# EAGLE design Net Widget (EAGLE 7.2.0)
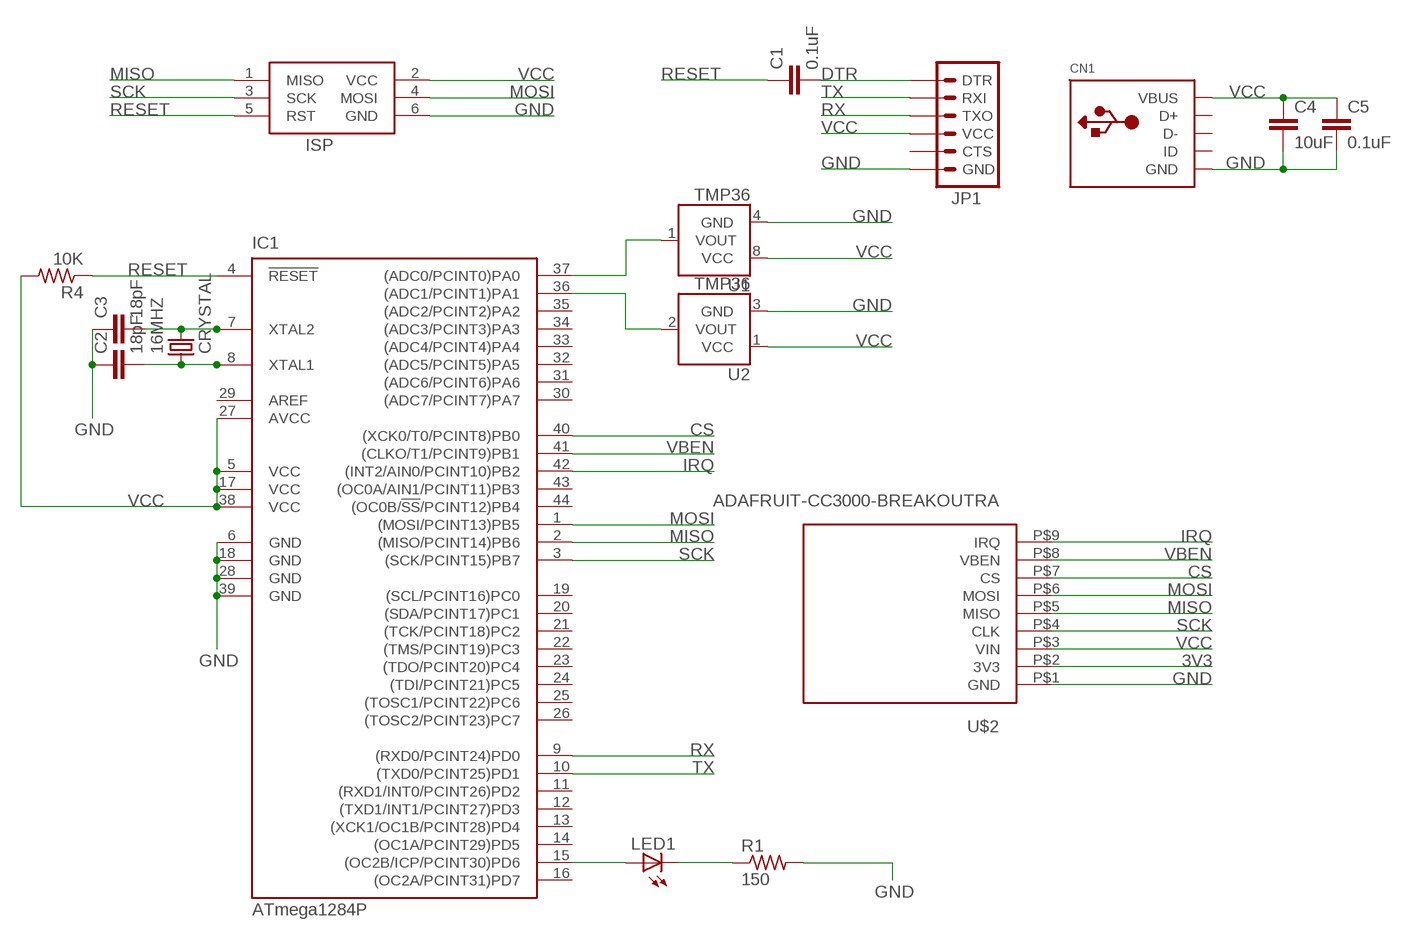
[diagram p0: schematic, sheet 1]

## Parts
16MHZ  CRYSTAL  [2-SMD-5X3MM]
C1  0.1uF  C-EUC1206  [C1206]
C2  18pF  C-EUC1206  [C1206]
C3  18pF  C-EUC1206  [C1206]
C4  10uF  C-EUC1206  [C1206]
C5  0.1uF  C-EUC1206  [C1206]
CN1  USBPWR  [USB-MINIB-POWER]
IC1  ATmega1284P  MEGA164P/324P/644P-AU  [TQFP44]
ISP  AVRISP-6  [AVRISP]
JP1  ARDUINO_SERIAL_PROGRAMSMD  [1X06-SMD]
LED1  LEDSMT1206  [1206]
R1  150  R-US_R1206  [R1206]
R4  10K  R-US_R1206  [R1206]
U1  TMP36  [SO08]
U2  TMP36  TMP36GT9  [TO-92]
U$2  ADAFRUIT-CC3000-BREAKOUTRA  [ADAFRUIT-CC3000-BREAKOUT-RA]

## Nets
3V3: U$2.P$2(3V3)
CS: IC1.40((XCK0/T0/PCINT8)PB0) U$2.P$7(CS)
DTR: C1.2 JP1.1(DTR)
GND [power]: C2.1 C3.1 C4.2 C5.2 CN1.GND IC1.6(GND) IC1.18(GND) IC1.28(GND) IC1.39(GND) ISP.6(GND) JP1.6(GND) R1.2 U1.4(GND) U2.3(GND) U$2.P$1(GND)
IRQ: IC1.42((INT2/AIN0/PCINT10)PB2) U$2.P$9(IRQ)
MISO: IC1.2((MISO/PCINT14)PB6) ISP.1(MISO) U$2.P$5(MISO)
MOSI: IC1.1((MOSI/PCINT13)PB5) ISP.4(MOSI) U$2.P$6(MOSI)
N$1: IC1.37((ADC0/PCINT0)PA0) U1.1(VOUT)
N$2: IC1.36((ADC1/PCINT1)PA1) U2.2(VOUT)
N$3: IC1.15((OC2B/ICP/PCINT30)PD6) LED1.A
N$4: LED1.C R1.1
N$6: 16MHZ.P$2 C3.2 IC1.7(XTAL2)
N$7: 16MHZ.P$1 C2.2 IC1.8(XTAL1)
RESET: C1.1 IC1.4(!RESET) ISP.5(RST) R4.1
RX: IC1.9((RXD0/PCINT24)PD0) JP1.3(TXO)
SCK: IC1.3((SCK/PCINT15)PB7) ISP.3(SCK) U$2.P$4(CLK)
TX: IC1.10((TXD0/PCINT25)PD1) JP1.2(RXI)
VBEN: IC1.41((CLKO/T1/PCINT9)PB1) U$2.P$8(VBEN)
VCC [power]: C4.1 C5.1 CN1.VBUS IC1.5(VCC) IC1.17(VCC) IC1.27(AVCC) IC1.38(VCC) ISP.2(VCC) JP1.4(VCC) R4.2 U1.8(VCC) U2.1(VCC) U$2.P$3(VIN)
Unconnected: CN1.D+ CN1.D- CN1.ID IC1.11((RXD1/INT0/PCINT26)PD2) IC1.12((TXD1/INT1/PCINT27)PD3) IC1.13((XCK1/OC1B/PCINT28)PD4) IC1.14((OC1A/PCINT29)PD5) IC1.16((OC2A/PCINT31)PD7) IC1.19((SCL/PCINT16)PC0) IC1.20((SDA/PCINT17)PC1) IC1.21((TCK/PCINT18)PC2) IC1.22((TMS/PCINT19)PC3) IC1.23((TDO/PCINT20)PC4) IC1.24((TDI/PCINT21)PC5) IC1.25((TOSC1/PCINT22)PC6) IC1.26((TOSC2/PCINT23)PC7) IC1.30((ADC7/PCINT7)PA7) IC1.31((ADC6/PCINT6)PA6) IC1.32((ADC5/PCINT5)PA5) IC1.33((ADC4/PCINT4)PA4) IC1.34((ADC3/PCINT3)PA3) IC1.35((ADC2/PCINT2)PA2) IC1.43((OC0A/AIN1/PCINT11)PB3) IC1.44((OC0B/!SS!/PCINT12)PB4) JP1.5(CTS)

## Power pins joined to a net without a drawn wire
AREF: IC1.29(AREF)

## Library data of the parts
16MHZ = Net Widget:CRYSTAL
C1-C5 = rcl:C-EU: CAPACITOR, European symbol
CN1 = Net Widget:USB: USB Connectors USBMINIB - Surface Mount Female Mini-B USB Connector 4UConnector: 06564 By microbuilder.eu Thru-hole RA Female Mini-B USB Connector 4UConnector: 18732 By ladyada.net
IC1 = avr-5:MEGA164P/324P/644P-AU
ISP = adafruit:AVRISP: AVR ISP HEADER Standard 6 pin header for AVR programming
JP1 = SparkFun-Connectors:ARDUINO_SERIAL_PROGRAM: FTDI connector footprints
LED1 = led:LED: LED OSRAM: - CHIPLED LG R971, LG N971, LY N971, LG Q971, LY Q971, LO R971, LY R971 LH N974, LH R974 LS Q976, LO Q976, LY Q976 LO Q996 - Hyper CHIPLED LW Q18S LB Q993, LB Q99A, LB R99A - SideLED LS A670, LO A670, LY A670, LG A670, LP A670 LB A673, LV A673, LT A673, LW A673 LH A674 LY A675 LS A676, LA A676, LO A676, LY A676, LW A676 LS A679, LY A679, LG A679 - Hyper Micro SIDELED® LS Y876, LA Y876, LO Y876, LY Y876 LT Y87S - SmartLED LW L88C, LW L88S LB L89C, LB L89S, LG L890 LS L89K, LO L89K, LY L89K LS L896, LA L896, LO L896, LY L896 - TOPLED LS T670, LO T670, LY T670, LG T670, LP T670 LSG T670, LSP T670, LSY T670, LOP T670, LYG T670 LG T671, LOG T671, LSG T671 LB T673, LV T673, LT T673, LW T673 LH T674 LS T676, LA T676, LO T676, LY T676, LB T676, LH T676, LSB T676, LW T676 LB T67C, LV T67C, LT T67C, LS T67K, LO T67K, LY T67K, LW E67C LS E67B, LA E67B, LO E67B, LY E67B, LB E67C, LV E67C, LT E67C LW T67C LS T679, LY T679, LG T679 LS T770, LO T770, LY T770, LG T770, LP T770 LB T773, LV T773, LT T773, LW T773 LH T774 LS E675, LA E675, LY E675, LS T675 LS T776, LA T776, LO T776, LY T776, LB T776 LHGB T686 LT T68C, LB T68C - Hyper Mini TOPLED® LB M676 - Mini TOPLED Santana® LG M470 LS M47K, LO M47K, LY M47K Source: http://www.osram.convergy.de LUXEON: - LUMILED® LXK2-PW12-R00, LXK2-PW12-S00, LXK2-PW14-U00, LXK2-PW14-V00 LXK2-PM12-R00, LXK2-PM12-S00, LXK2-PM14-U00 LXK2-PE12-Q00, LXK2-PE12-R00, LXK2-PE12-S00, LXK2-PE14-T00, LXK2-PE14-U00 LXK2-PB12-K00, LXK2-PB12-L00, LXK2-PB12-M00, LXK2-PB14-N00, LXK2-PB14-P00, LXK2-PB14-Q00 LXK2-PR12-L00, LXK2-PR12-M00, LXK2-PR14-Q00, LXK2-PR14-R00 LXK2-PD12-Q00, LXK2-PD12-R00, LXK2-PD12-S00 LXK2-PH12-R00, LXK2-PH12-S00 LXK2-PL12-P00, LXK2-PL12-Q00, LXK2-PL12-R00 Source: www.luxeon.com KINGBRIGHT: KA-3528ASYC Source: www.kingbright.com
R1 R4 = rcl:R-US_: RESISTOR, American symbol
U1 U2 = Net Widget:TMP36: Precision degC temp sensor, analog out
U$2 = Net Widget:ADAFRUIT-CC3000-BREAKOUT: Adafruit CC3000 Breakout Board: http://www.adafruit.com/products/1469

## Net classes
1 power: width 0.406 mm

## Board
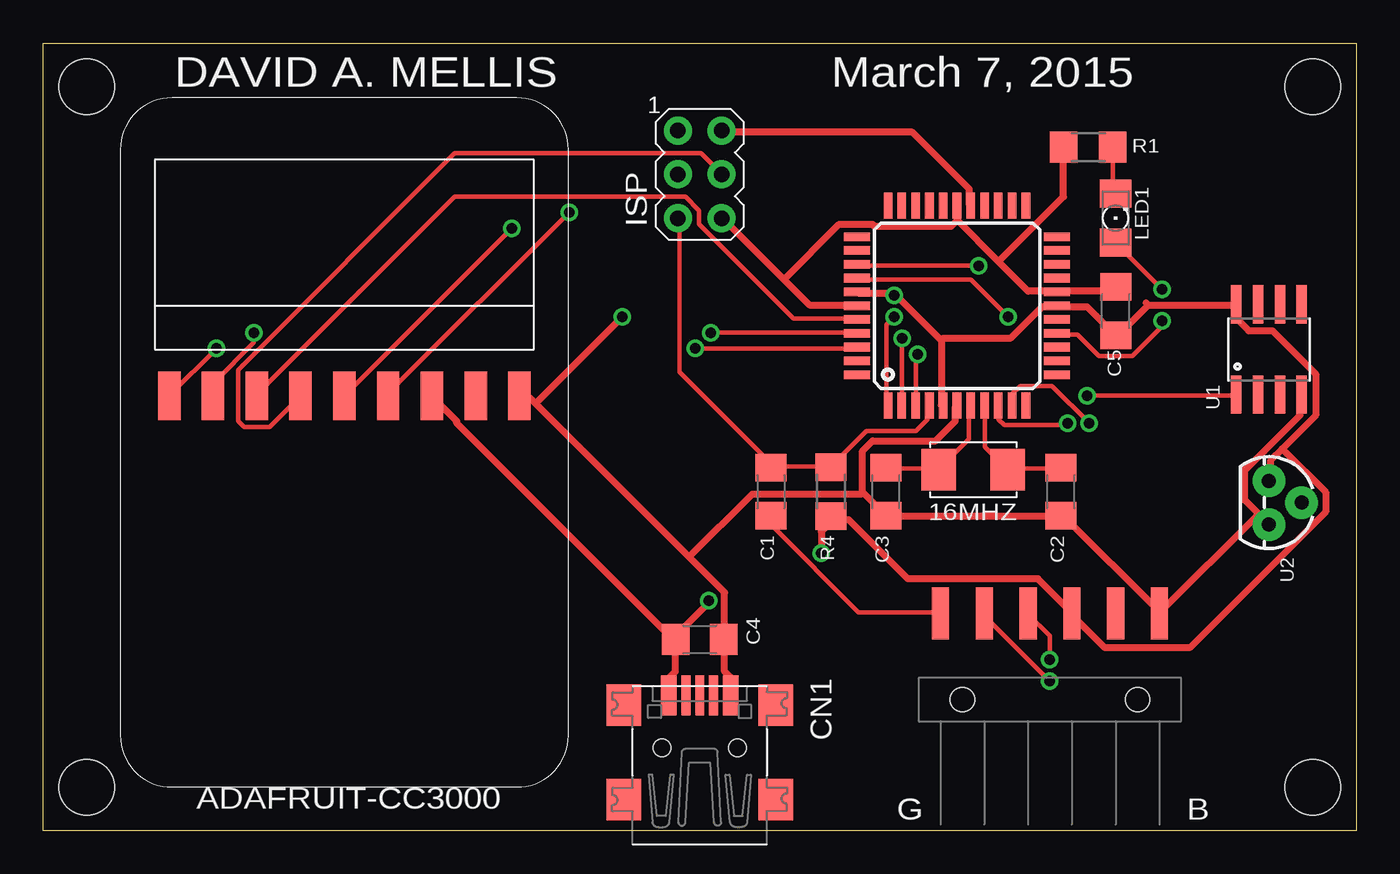
[diagram p1: board, top side]
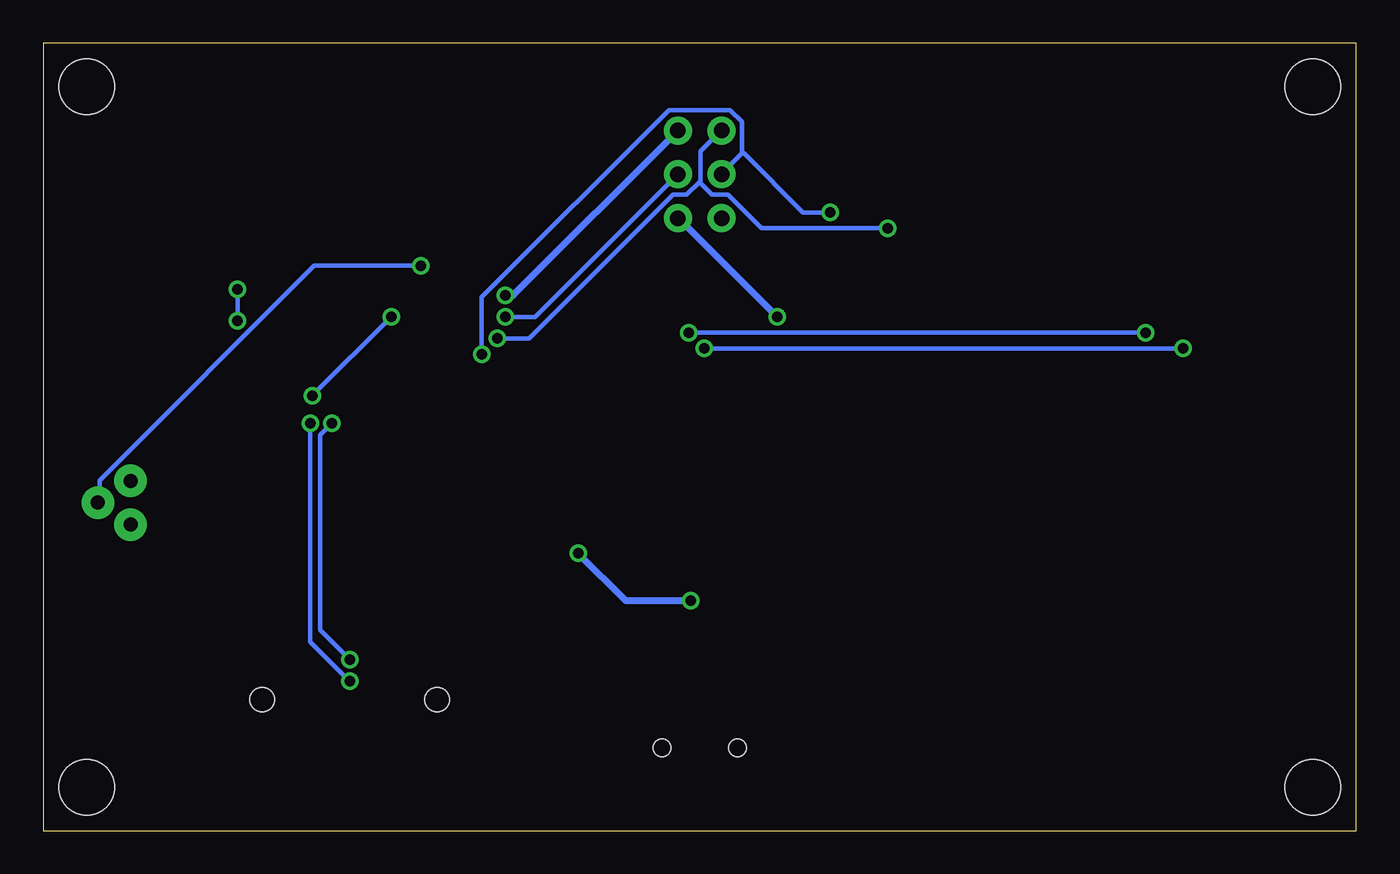
[diagram p2: board, bottom side, seen from below]

Size 76.2 x 45.72 mm. Coordinates in mm from the lower left corner, seen from the top.
Outline: 76.2,0 0,0 0,45.72 76.2,45.72 76.2,0
Copper layers (1*16): Top 0.035mm / dielectric 1.5mm / Bottom 0.035mm
Design rules "default *": minimum track width 10mil, minimum drill 24mil, track to track 8mil, track to pad 8mil, pad to pad 8mil, via to via 8mil, smd to smd 8mil, copper to edge 40mil, drill to drill 8mil, minimum pad ring 10mil, minimum via ring 8mil, stop-mask expansion 4mil, vias tented up to drill 0mil, thermal gap 10mil
Holes 3.2 mm at 73.66,2.54 73.66,43.18 2.54,43.18 2.54,2.54
bRestrict: area 48.3,17.8 to 59.7,25.4

### Footprints (pad centres in the part's own frame; a part is rotated, then mirrored left to right if it is on the bottom)
2-SMD-5X3MM = smd 2 x 2.4: P$1 -2,0; P$2 2,0
C1206 = smd 1.6 x 1.8: 1 -1.4,0; 2 1.4,0
USB-MINIB-POWER = smd 0.5 x 2.308: D+ 0,5.334; D- -0.8,5.334; ID 0.8,5.334 | smd 0.9 x 2.308: GND 1.8,5.334; VBUS -1.8,5.334 | smd 2 x 2.4: GND1 -4.4,-0.73; GND2 -4.4,4.77; GND3 4.4,4.77; GND4 4.4,-0.73 | hole 1: -2.2,2.27; 2.2,2.27
TQFP44 = smd 1.5 x 0.5: 1 -5.8,4; 2 -5.8,3.2; 3 -5.8,2.4; 4 -5.8,1.6; 5 -5.8,0.8; 6 -5.8,0; 7 -5.8,-0.8; 8 -5.8,-1.6; 9 -5.8,-2.4; 10 -5.8,-3.2; 11 -5.8,-4; 23 5.8,-4; 24 5.8,-3.2; 25 5.8,-2.4; 26 5.8,-1.6; 27 5.8,-0.8; 28 5.8,0; 29 5.8,0.8; 30 5.8,1.6; 31 5.8,2.4; 32 5.8,3.2; 33 5.8,4 | smd 0.5 x 1.5: 12 -4,-5.8; 13 -3.2,-5.8; 14 -2.4,-5.8; 15 -1.6,-5.8; 16 -0.8,-5.8; 17 0,-5.8; 18 0.8,-5.8; 19 1.6,-5.8; 20 2.4,-5.8; 21 3.2,-5.8; 22 4,-5.8; 34 4,5.8; 35 3.2,5.8; 36 2.4,5.8; 37 1.6,5.8; 38 0.8,5.8; 39 0,5.8; 40 -0.8,5.8; 41 -1.6,5.8; 42 -2.4,5.8; 43 -3.2,5.8; 44 -4,5.8
AVRISP = drill 0.9 pad 1.626: 1 -1.27,2.54; 2 1.27,2.54; 3 -1.27,0; 4 1.27,0; 5 -1.27,-2.54; 6 1.27,-2.54
1X06-SMD = smd 1 x 3: 1 -6.35,5; 2 -3.81,5; 3 -1.27,5; 4 1.27,5; 5 3.81,5; 6 6.35,5 | hole 1.4: -5.08,0; 5.08,0
1206 = smd 1.6 x 1.803: A -1.422,0; C 1.422,0
R1206 = smd 1.6 x 1.803: 1 -1.422,0; 2 1.422,0
SO08 = smd 0.61 x 2.21: 1 -1.905,-2.616; 2 -0.635,-2.616; 3 0.635,-2.616; 4 1.905,-2.616; 5 1.905,2.616; 6 0.635,2.616; 7 -0.635,2.616; 8 -1.905,2.616
TO-92 = drill 0.813 pad 1.88: 1 -1.27,0; 2 0,1.905; 3 1.27,0
ADAFRUIT-CC3000-BREAKOUT-RA = smd 1.3 x 2.8: P$1 2.84,17.3; P$2 5.38,17.3; P$3 7.92,17.3; P$4 10.46,17.3; P$5 13,17.3; P$6 15.54,17.3; P$7 18.08,17.3; P$8 20.62,17.3; P$9 23.16,17.3

### Placement (x,y rotation side)
16MHZ  53.98,20.95 180 top
C1  42.23,19.68 270 top
C2  59.05,19.68 90 top
C3  48.9,19.68 90 top
C4  38.1,11.11 0 top
C5  62.23,30.16 90 top
CN1  38.1,2.54 0 top
IC1  53.02,30.48 90 top
ISP  38.1,38.1 0 top
JP1  58.42,7.62 0 top
LED1  62.23,35.56 90 top
R1  60.64,39.69 180 top
R4  45.72,19.68 270 top
U1  71.12,27.94 0 top
U2  71.12,19.05 270 top
U$2  30.48,42.55 180 top

### Tracks (layer width: path | path; a pad name or v marks a point on that pad's centre or on a via)
CS
  Top 0.254: IC1.40 47.21,29.72 43.55,29.72 38.06,35.2 38.06,36.01 37.26,36.8 23.89,36.8 12.34,25.26 U$2.P$7
DTR
  Top 0.254: C1.2 42.29,18.17 42.29,17.72 47.32,12.69 52.01,12.69 JP1.1
GND  (via drill 0.61)
  Top 0.406: C5.2 62.18,31.55 61.95,31.32 58.86,31.32 IC1.18 58.64,31.32 57.15,31.32 55.44,33.03 | 53.03,35.43 53.03,36.23 IC1.28 | 55.44,33.03 53.03,35.43 | 42.98,32 39.43,35.55 ISP.6 | 42.98,32 44.46,30.52 47.21,30.52 IC1.39 | 53.03,35.43 52.69,35.09 48.23,35.09 48.12,35.2 46.18,35.2 42.98,32 | 69.72,20.92 72.92,24.12 72.92,25.26 U1.4 | 69.72,20.92 69.72,19.2 71.09,17.83 U2.3 | 71.09,17.72 U2.3 | 47.55,19.66 47.55,22.06 48.12,22.63 51.78,22.63 52.92,23.77 52.92,24.57 IC1.6 | 47.55,19.66 48.81,18.4 C3.1 C2.1 59.21,18.29 64.69,12.8 JP1.6 64.81,12.69 70.41,18.29 U2.3 | CN1.GND 39.89,7.89 39.89,8.91 39.55,9.26 39.55,11.09 C4.2 39.55,11.32 39.55,13.83 37.49,15.89 | 37.49,15.89 28.57,24.8 | 28.57,24.8 28.23,25.15 27.66,25.15 U$2.P$1 | 37.49,15.89 41.15,19.55 47.43,19.55 47.55,19.66 | 28.57,24.8 v33.6,29.83 | 69.61,21.03 69.72,20.92 | 55.44,33.03 59.21,36.8 59.21,39.66 R1.2
  Bottom 0.406: v33.6,29.83 39.32,35.55 ISP.6
IRQ  (via drill 0.61)
  Top 0.254: v37.83,28 47.21,28 IC1.42 | v10.06,28 U$2.P$9
  Bottom 0.254: v10.06,28 v37.83,28
MISO  (via drill 0.61)
  Top 0.254: v49.84,28.57 49.84,24.69 IC1.2 | v27.2,34.98 U$2.P$5
  Bottom 0.254: v49.84,28.57 48.01,28.57 39.66,36.92 38.86,36.92 38.12,37.66 | 38.12,37.66 38.06,37.72 38.06,39.43 36.92,40.58 ISP.1 | v27.2,34.98 34.52,34.98 36.46,36.92 37.38,36.92 38.12,37.66
MOSI  (via drill 0.61)
  Top 0.254: v49.38,29.83 48.92,29.38 48.92,24.69 IC1.1 | U$2.P$6 14.86,25.15 13.14,23.43 11.66,23.43 11.32,23.77 11.32,26.75 23.89,39.32 38.18,39.32 39.32,38.18 ISP.4
  Bottom 0.254: v49.38,29.83 47.66,29.83 39.43,38.06 ISP.4
N$1  (via drill 0.61)
  Top 0.254: v56.01,29.83 53.84,32 47.32,32 IC1.37 | v60.58,25.26 69.15,25.26 U1.1
  Bottom 0.254: v60.58,25.26 v56.01,29.83
N$2  (via drill 0.61)
  Top 0.254: v54.29,32.8 47.32,32.8 IC1.36
  Bottom 0.254: v54.29,32.8 60.47,32.8 72.92,20.34 72.92,19.09 U2.2
N$3  (via drill 0.61)
  Top 0.254: v64.92,29.6 64.92,29.26 63.21,27.55 61.27,27.55 60.01,28.8 58.86,28.8 IC1.15 | v64.92,31.43 62.29,34.06 LED1.A
  Bottom 0.254: v64.92,31.43 v64.92,29.6
N$4
  Top 0.254: R1.1 62.06,39.66 62.06,37.15 62.18,37.03 LED1.C
N$6
  Top 0.254: 53.84,24.69 IC1.7 53.72,24.57 53.72,22.75 52.01,21.03 16MHZ.P$2 51.89,21.03 48.92,21.03 C3.2
N$7
  Top 0.254: 54.63,24.69 IC1.8 54.63,24.57 54.63,22.29 55.89,21.03 16MHZ.P$1 56.01,21.03 58.98,21.03 C2.2
RESET
  Top 0.254: IC1.4 51.32,24.57 51.32,23.89 50.63,23.2 47.78,23.2 45.72,21.14 R4.1 45.61,21.14 42.29,21.14 C1.1 42.29,21.26 36.92,26.63 36.92,35.55 ISP.5
RX  (via drill 0.61)
  Top 0.254: v59.44,23.66 59.32,23.55 55.78,23.55 55.44,23.89 55.44,24.57 IC1.9 | v58.41,9.94 58.41,11.32 57.15,12.57 JP1.3
  Bottom 0.254: v59.44,23.66 60.12,22.97 60.12,11.66 v58.41,9.94
SCK  (via drill 0.61)
  Top 0.254: v50.75,27.66 50.63,27.55 50.63,24.69 IC1.3 | v30.52,35.89 20.12,25.49 20.12,25.26 U$2.P$4
  Bottom 0.254: v50.75,27.66 50.75,30.98 39.89,41.83 36.35,41.83 35.66,41.15 35.66,39.32 | 35.66,39.32 36.8,38.18 ISP.3 | v30.52,35.89 32.12,35.89 35.55,39.32 35.66,39.32
TX  (via drill 0.61)
  Top 0.254: v60.69,23.66 58.52,25.83 56.69,25.83 56.24,25.38 56.24,24.69 IC1.10 | v58.41,8.69 54.52,12.57 JP1.2
  Bottom 0.254: v60.69,23.66 60.69,10.97 v58.41,8.69
VBEN  (via drill 0.61)
  Top 0.254: v38.75,28.92 47.21,28.92 IC1.41 | v12.23,28.92 12.23,28.35 9.94,26.06 9.94,25.26 U$2.P$8
  Bottom 0.254: v12.23,28.92 v38.75,28.92
VCC  (via drill 0.61)
  Top 0.406: C4.1 36.69,11.09 36.69,9.26 36.35,8.91 36.35,7.89 CN1.VBUS | U$2.P$3 22.63,25.15 24,23.77 24,23.66 36.58,11.09 C4.1 | 52.12,28.46 52.12,24.69 IC1.5 | 49.44,31.15 49.38,31.2 47.32,31.2 IC1.38 | 49.44,31.15 52.12,28.46 | IC1.27 53.72,36.35 53.72,37.26 50.41,40.58 39.43,40.58 ISP.2 | v49.38,31.09 49.44,31.15 | 45.72,18.17 R4.2 | 64.12,30.52 69.15,30.52 U1.8 69.27,30.4 69.27,29.72 69.95,29.03 71.32,29.03 73.84,26.52 73.84,24.12 71.89,22.17 | 64.12,30.52 62.41,28.8 C5.1 62.18,28.8 60.58,30.4 58.86,30.4 IC1.17 58.64,30.4 57.95,30.4 56.12,28.57 52.23,28.57 52.12,28.46 | 71.89,22.17 71.21,21.49 71.21,20.34 U2.1 | 64.01,30.63 64.12,30.52 | R4.2 45.83,18.06 46.75,18.06 50.18,14.63 57.72,14.63 59.66,12.69 JP1.4 59.78,12.46 61.61,10.63 66.52,10.63 74.41,18.52 74.41,19.66 71.89,22.17 | v38.63,13.37 38.63,13.26 36.69,11.32 C4.1 | v45.15,16.12 45.15,17.37 45.72,17.95 R4.2
  Bottom 0.406: v49.38,31.09 48.92,31.09 ISP.2 | 71.09,20.23 U2.1 | v38.63,13.37 42.41,13.37 v45.15,16.12

### Text on the board
tNames: DAVID A. MELLIS | March 7, 2015 | ADAFRUIT-CC3000 | G | B